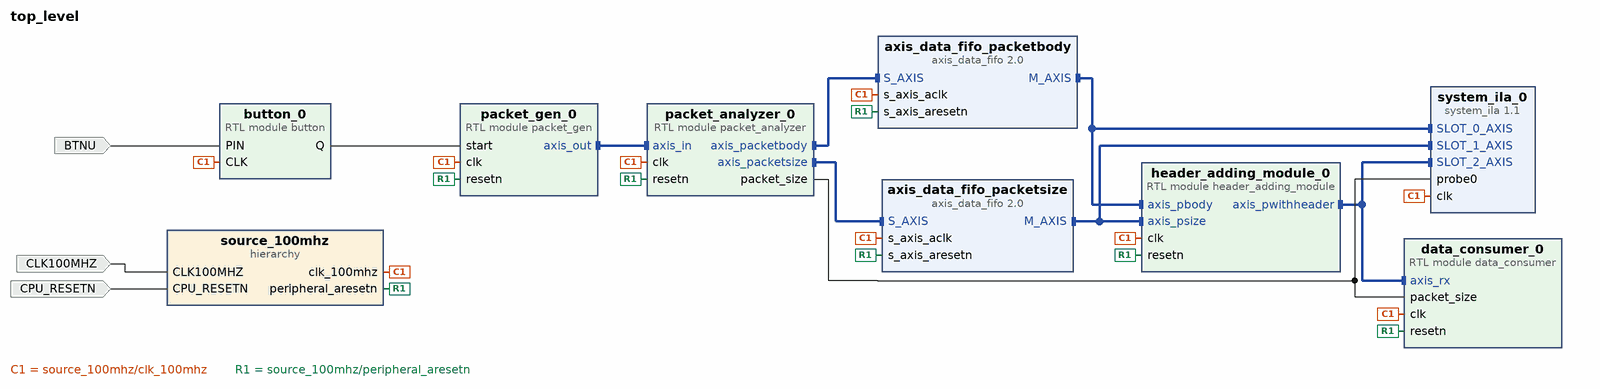
[diagram p0: block diagram of the top level]
# Vivado block design top_level, xc7a100tcsg324-1, Vivado 2021.1.1
create_bd_design top_level

create_bd_port -dir I -type clk CLK100MHZ
create_bd_port -dir I -type rst CPU_RESETN
create_bd_port -dir I BTNU

create_bd_cell -type module -reference button button_0
create_bd_cell -type hier source_100mhz
create_bd_cell -type ip -vlnv xilinx.com:ip:axis_data_fifo:2.0 axis_data_fifo_packetbody
set_property -dict {CONFIG.FIFO_DEPTH 2048} [get_bd_cells axis_data_fifo_packetbody]
create_bd_cell -type ip -vlnv xilinx.com:ip:system_ila:1.1 system_ila_0
set_property -dict [list \
  CONFIG.C_MON_TYPE MIX \
  CONFIG.C_NUM_MONITOR_SLOTS 3 \
  CONFIG.C_SLOT 0 \
  CONFIG.C_SLOT_0_INTF_TYPE xilinx.com:interface:axis_rtl:1.0 \
  CONFIG.C_SLOT_1_INTF_TYPE xilinx.com:interface:axis_rtl:1.0 \
  CONFIG.C_SLOT_2_INTF_TYPE xilinx.com:interface:axis_rtl:1.0 \
  CONFIG.C_SLOT_3_INTF_TYPE xilinx.com:interface:axis_rtl:1.0 \
] [get_bd_cells system_ila_0]
create_bd_cell -type ip -vlnv xilinx.com:ip:axis_data_fifo:2.0 axis_data_fifo_packetsize
create_bd_cell -type module -reference packet_analyzer packet_analyzer_0
create_bd_cell -type module -reference packet_gen packet_gen_0
create_bd_cell -type module -reference data_consumer data_consumer_0
create_bd_cell -type module -reference header_adding_module header_adding_module_0

# ---- hierarchy /source_100mhz ----
current_bd_instance /source_100mhz
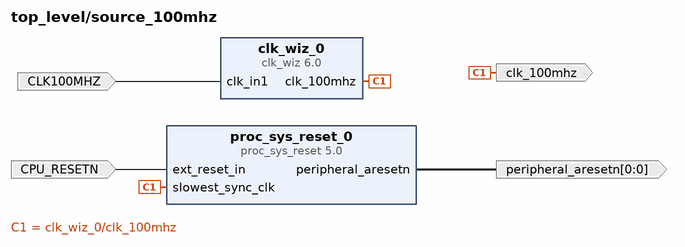
[diagram p1: block diagram inside /source_100mhz]
create_bd_pin -dir O -type clk clk_100mhz
create_bd_pin -dir I -type rst CPU_RESETN
create_bd_pin -dir O -from 0 -to 0 -type rst peripheral_aresetn
create_bd_pin -dir I -type clk CLK100MHZ

create_bd_cell -type ip -vlnv xilinx.com:ip:proc_sys_reset:5.0 proc_sys_reset_0
create_bd_cell -type ip -vlnv xilinx.com:ip:clk_wiz:6.0 clk_wiz_0
set_property -dict {CONFIG.CLK_OUT1_PORT clk_100mhz CONFIG.USE_LOCKED false CONFIG.USE_RESET false} [get_bd_cells clk_wiz_0]

# ---- connections ----

current_bd_instance /source_100mhz
connect_bd_net -net clk_in1_0_1 [get_bd_pins CLK100MHZ] [get_bd_pins clk_wiz_0/clk_in1]
connect_bd_net [get_bd_pins clk_wiz_0/clk_100mhz] [get_bd_pins clk_100mhz] [get_bd_pins proc_sys_reset_0/slowest_sync_clk]
connect_bd_net -net ext_reset_in_0_1 [get_bd_pins CPU_RESETN] [get_bd_pins proc_sys_reset_0/ext_reset_in]
connect_bd_net [get_bd_pins proc_sys_reset_0/peripheral_aresetn] [get_bd_pins peripheral_aresetn]

current_bd_instance /
connect_bd_intf_net [get_bd_intf_pins header_adding_module_0/axis_pbody] [get_bd_intf_pins axis_data_fifo_packetbody/M_AXIS]
connect_bd_intf_net [get_bd_intf_pins header_adding_module_0/axis_pbody] [get_bd_intf_pins system_ila_0/SLOT_0_AXIS]
connect_bd_intf_net [get_bd_intf_pins axis_data_fifo_packetsize/M_AXIS] [get_bd_intf_pins header_adding_module_0/axis_psize]
connect_bd_intf_net [get_bd_intf_pins axis_data_fifo_packetsize/M_AXIS] [get_bd_intf_pins system_ila_0/SLOT_1_AXIS]
connect_bd_intf_net [get_bd_intf_pins header_adding_module_0/axis_pwithheader] [get_bd_intf_pins data_consumer_0/axis_rx]
connect_bd_intf_net [get_bd_intf_pins header_adding_module_0/axis_pwithheader] [get_bd_intf_pins system_ila_0/SLOT_2_AXIS]
connect_bd_intf_net [get_bd_intf_pins packet_analyzer_0/axis_packetbody] [get_bd_intf_pins axis_data_fifo_packetbody/S_AXIS]
connect_bd_intf_net [get_bd_intf_pins packet_analyzer_0/axis_packetsize] [get_bd_intf_pins axis_data_fifo_packetsize/S_AXIS]
connect_bd_intf_net [get_bd_intf_pins packet_gen_0/axis_out] [get_bd_intf_pins packet_analyzer_0/axis_in]
connect_bd_net -net PIN_0_1 [get_bd_ports BTNU] [get_bd_pins button_0/PIN]
connect_bd_net [get_bd_pins button_0/Q] [get_bd_pins packet_gen_0/start]
connect_bd_net -net clk_in1_0_1 [get_bd_ports CLK100MHZ] [get_bd_pins source_100mhz/CLK100MHZ]
connect_bd_net -net clk_wiz_0_clk_100mhz [get_bd_pins source_100mhz/clk_100mhz] \
  [get_bd_pins button_0/CLK] [get_bd_pins axis_data_fifo_packetbody/s_axis_aclk] [get_bd_pins system_ila_0/clk] \
  [get_bd_pins axis_data_fifo_packetsize/s_axis_aclk] [get_bd_pins packet_analyzer_0/clk] [get_bd_pins packet_gen_0/clk] \
  [get_bd_pins data_consumer_0/clk] [get_bd_pins header_adding_module_0/clk]
connect_bd_net -net ext_reset_in_0_1 [get_bd_ports CPU_RESETN] [get_bd_pins source_100mhz/CPU_RESETN]
connect_bd_net [get_bd_pins packet_analyzer_0/packet_size] [get_bd_pins system_ila_0/probe0] [get_bd_pins data_consumer_0/packet_size]
connect_bd_net -net proc_sys_reset_0_peripheral_aresetn [get_bd_pins source_100mhz/peripheral_aresetn] \
  [get_bd_pins axis_data_fifo_packetbody/s_axis_aresetn] [get_bd_pins axis_data_fifo_packetsize/s_axis_aresetn] \
  [get_bd_pins packet_analyzer_0/resetn] [get_bd_pins packet_gen_0/resetn] [get_bd_pins data_consumer_0/resetn] \
  [get_bd_pins header_adding_module_0/resetn]

validate_bd_design
save_bd_design
